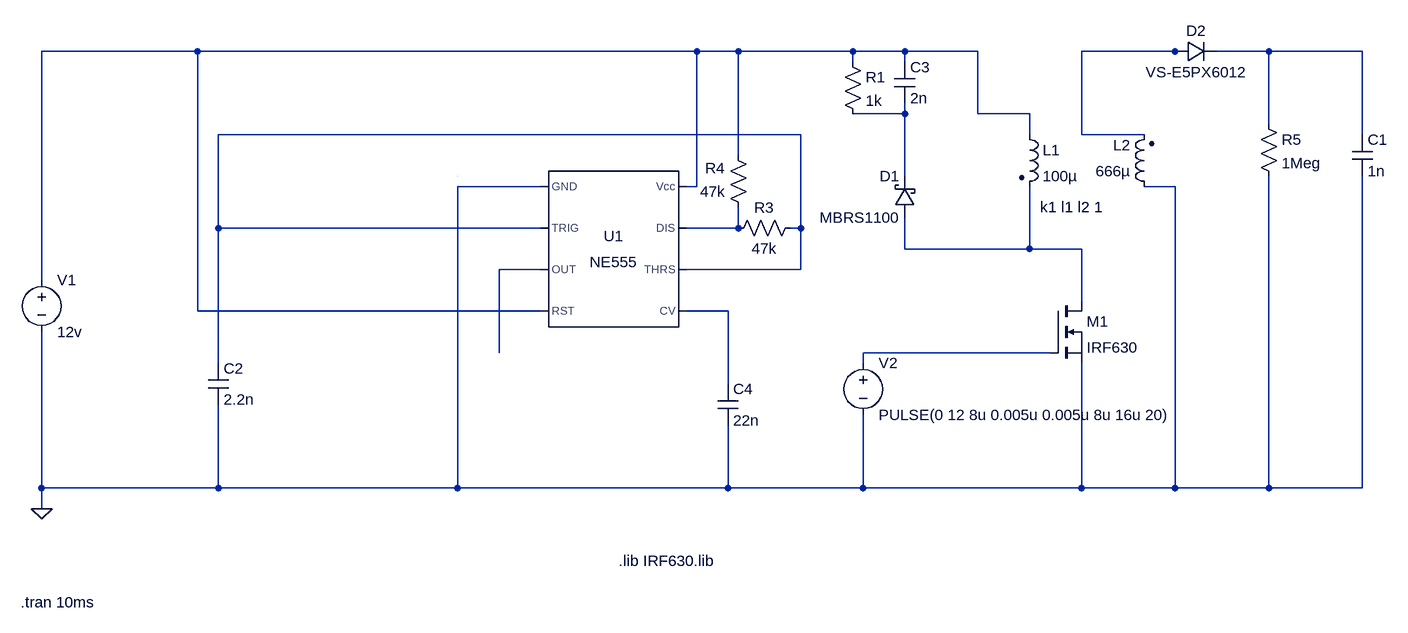
[diagram p0: schematic Geiger_simplified.asc]
Geiger_simplified.asc, the LTspice schematic file:
Version 4
SHEET 1 2004 680
WIRE -400 -192 -640 -192
WIRE 368 -192 -400 -192
WIRE 432 -192 368 -192
WIRE 608 -192 432 -192
WIRE 688 -192 608 -192
WIRE 800 -192 688 -192
WIRE 1104 -192 960 -192
WIRE 1120 -192 1104 -192
WIRE 1248 -192 1168 -192
WIRE 1392 -192 1248 -192
WIRE 608 -176 608 -192
WIRE 688 -176 688 -192
WIRE 688 -96 688 -112
WIRE 688 -96 608 -96
WIRE 800 -96 800 -192
WIRE 880 -96 800 -96
WIRE 1248 -80 1248 -192
WIRE 528 -64 -368 -64
WIRE 880 -64 880 -96
WIRE 960 -64 960 -192
WIRE 1056 -64 960 -64
WIRE 1392 -64 1392 -192
WIRE 432 -32 432 -192
WIRE 688 0 688 -96
WIRE 128 16 0 16
WIRE 368 16 368 -192
WIRE 368 16 352 16
WIRE 1104 16 1056 16
WIRE -368 80 -368 -64
WIRE 128 80 -368 80
WIRE 432 80 432 48
WIRE 432 80 352 80
WIRE 528 80 528 -64
WIRE 528 80 512 80
WIRE 688 112 688 64
WIRE 880 112 880 16
WIRE 880 112 688 112
WIRE 960 112 880 112
WIRE 128 144 64 144
WIRE 528 144 528 80
WIRE 528 144 352 144
WIRE -640 160 -640 -192
WIRE 960 192 960 112
WIRE -400 208 -400 -192
WIRE 128 208 -400 208
WIRE 416 208 352 208
WIRE 64 272 64 144
WIRE 912 272 624 272
WIRE -368 288 -368 80
WIRE 624 288 624 272
WIRE 416 320 416 208
WIRE -640 480 -640 240
WIRE -368 480 -368 352
WIRE -368 480 -640 480
WIRE 0 480 0 16
WIRE 0 480 -368 480
WIRE 416 480 416 384
WIRE 416 480 0 480
WIRE 624 480 624 368
WIRE 624 480 416 480
WIRE 960 480 960 288
WIRE 960 480 624 480
WIRE 1104 480 1104 16
WIRE 1104 480 960 480
WIRE 1248 480 1248 0
WIRE 1248 480 1104 480
WIRE 1392 480 1392 0
WIRE 1392 480 1248 480
WIRE -640 512 -640 480
WIRE 0 0 0 0
FLAG -640 512 0
SYMBOL NE555 240 112 R0
SYMATTR InstName U1
SYMBOL cap -384 288 R0
SYMATTR InstName C2
SYMATTR Value 2.2n
SYMBOL voltage -640 144 R0
WINDOW 123 0 0 Left 0
WINDOW 39 0 0 Left 0
SYMATTR InstName V1
SYMATTR Value 12v
SYMBOL nmos 912 192 R0
SYMATTR InstName M1
SYMATTR Value IRF630
SYMBOL ind2 864 -80 R0
SYMATTR InstName L1
SYMATTR Value 100µ
SYMATTR Type ind
SYMATTR SpiceLine Ipk=0.4 Rser=1m Rpar=0
SYMBOL ind2 1072 32 R180
WINDOW 0 36 80 Left 2
WINDOW 3 36 40 Left 2
SYMATTR InstName L2
SYMATTR Value 666µ
SYMATTR Type ind
SYMATTR SpiceLine Rser=1m Rpar=0
SYMBOL res 528 64 R90
WINDOW 0 0 56 VBottom 2
WINDOW 3 32 56 VTop 2
SYMATTR InstName R3
SYMATTR Value 47k
SYMBOL res 448 64 R180
WINDOW 0 36 76 Left 2
WINDOW 3 36 40 Left 2
SYMATTR InstName R4
SYMATTR Value 47k
SYMBOL cap 400 320 R0
SYMATTR InstName C4
SYMATTR Value 22n
SYMBOL schottky 704 64 R180
WINDOW 0 24 64 Left 2
WINDOW 3 24 0 Left 2
SYMATTR InstName D1
SYMATTR Value MBRS1100
SYMATTR Description Diode
SYMATTR Type diode
SYMBOL voltage 624 272 R0
WINDOW 123 0 0 Left 0
WINDOW 39 0 0 Left 0
SYMATTR InstName V2
SYMATTR Value PULSE(0 12 8u 0.005u 0.005u 8u 16u 20)
SYMBOL cap 672 -176 R0
SYMATTR InstName C3
SYMATTR Value 2n
SYMBOL res 592 -192 R0
SYMATTR InstName R1
SYMATTR Value 1k
SYMBOL res 1232 -96 R0
SYMATTR InstName R5
SYMATTR Value 1Meg
SYMBOL diode 1104 -176 R270
WINDOW 0 32 32 VTop 2
WINDOW 3 0 32 VBottom 2
SYMATTR InstName D2
SYMATTR Value VS-E5PX6012
SYMBOL cap 1376 -64 R0
SYMATTR InstName C1
SYMATTR Value 1n
TEXT 896 48 Left 2 !k1 l1 l2 1
TEXT -672 656 Left 2 !.tran 10ms
TEXT 248 592 Left 2 !.lib IRF630.lib

The netlist it stands for:
* Geiger_simplified.asc
XU1 0 N005 N008 N001 N009 N005 N006 N001 NE555  ; pins GND TRIG OUT RST CV THRS DIS Vcc
C2 N005 0 2.2n
V1 N001 0 12v
M1 N007 N010 0 0 IRF630
L1 N001 N007 100µ Ipk=0.4 Rser=1m Rpar=0
L2 0 N002 666µ Rser=1m Rpar=0
R3 N005 N006 47k
R4 N006 N001 47k
C4 N009 0 22n
D1 N007 N004 MBRS1100
V2 N010 0 PULSE(0 12 8u 0.005u 0.005u 8u 16u 20)
C3 N001 N004 2n
R1 N001 N004 1k
R5 N003 0 1Meg
D2 N002 N003 VS-E5PX6012
C1 N003 0 1n
.model D D
.lib standard.dio
.model NMOS NMOS
.model PMOS PMOS
.lib standard.mos
k1 l1 l2 1
.tran 10ms
.lib IRF630.lib
.lib NE555.sub
.backanno
.end